# Altium schematic sheet Underglow.SchDoc
size A4; SheetNumber: 1; SheetTotal: 4
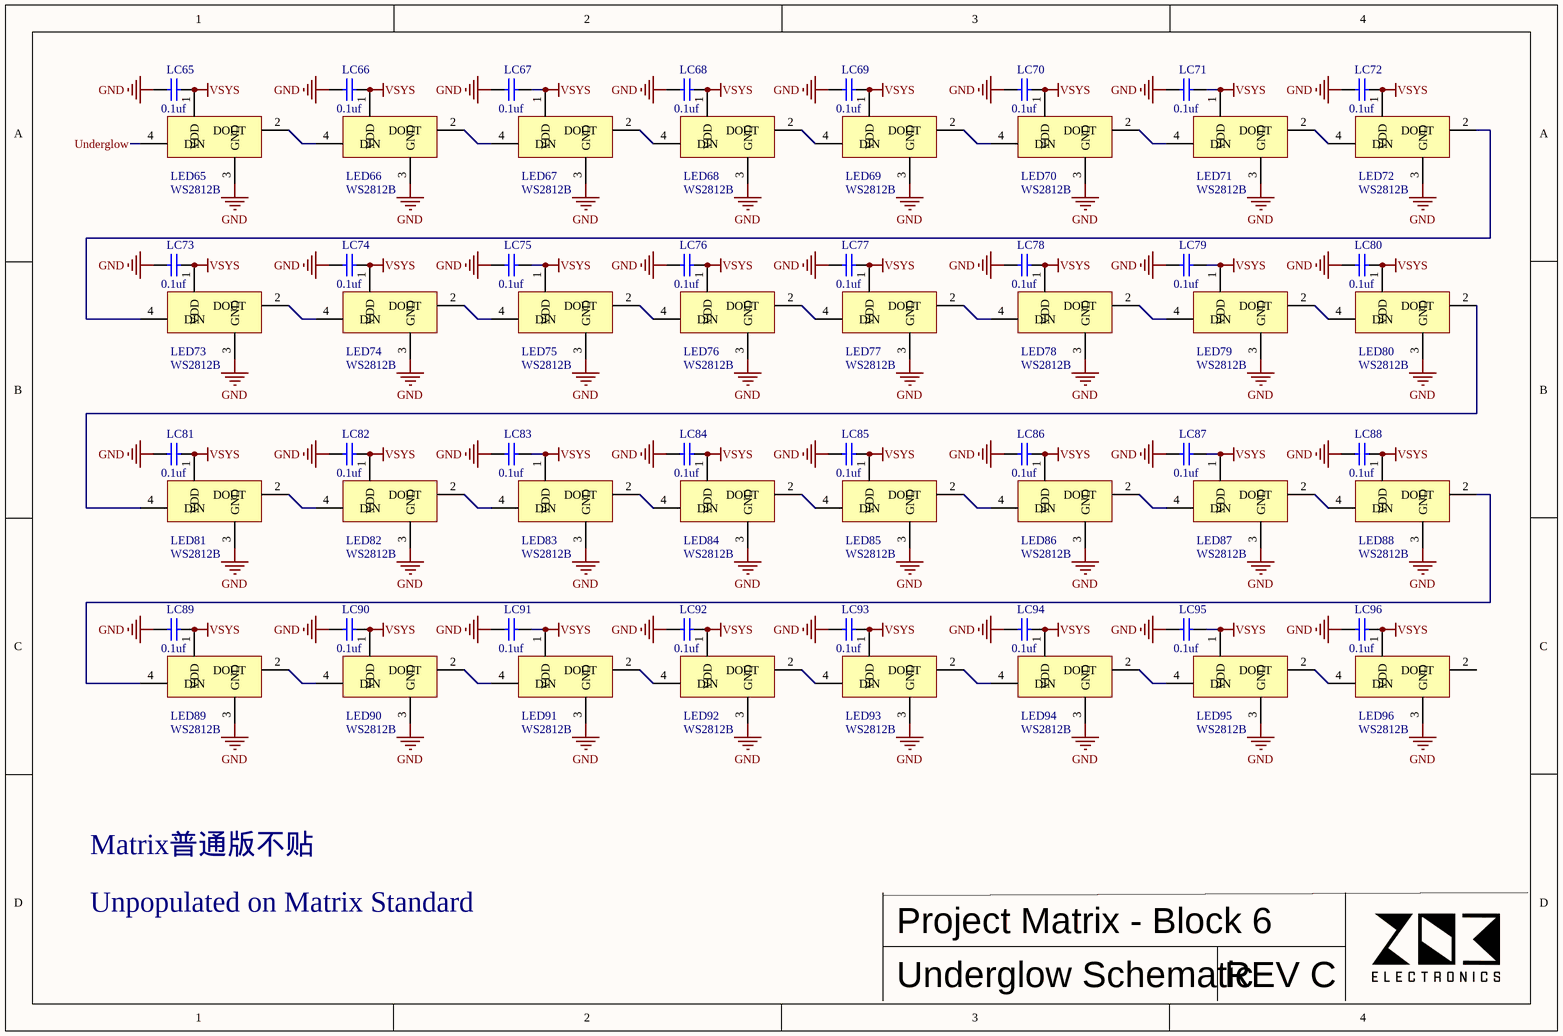
[diagram p0: Underglow.SchDoc]

## Parts
LC65  value 0.1uf  [0603 CAP]  (hidden comment: Cap Semi)
LC66  value 0.1uf  [0603 CAP]  (hidden comment: Cap Semi)
LC67  value 0.1uf  [0603 CAP]  (hidden comment: Cap Semi)
LC68  value 0.1uf  [0603 CAP]  (hidden comment: Cap Semi)
LC69  value 0.1uf  [0603 CAP]  (hidden comment: Cap Semi)
LC70  value 0.1uf  [0603 CAP]  (hidden comment: Cap Semi)
LC71  value 0.1uf  [0603 CAP]  (hidden comment: Cap Semi)
LC72  value 0.1uf  [0603 CAP]  (hidden comment: Cap Semi)
LC73  value 0.1uf  [0603 CAP]  (hidden comment: Cap Semi)
LC74  value 0.1uf  [0603 CAP]  (hidden comment: Cap Semi)
LC75  value 0.1uf  [0603 CAP]  (hidden comment: Cap Semi)
LC76  value 0.1uf  [0603 CAP]  (hidden comment: Cap Semi)
LC77  value 0.1uf  [0603 CAP]  (hidden comment: Cap Semi)
LC78  value 0.1uf  [0603 CAP]  (hidden comment: Cap Semi)
LC79  value 0.1uf  [0603 CAP]  (hidden comment: Cap Semi)
LC80  value 0.1uf  [0603 CAP]  (hidden comment: Cap Semi)
LC81  value 0.1uf  [0603 CAP]  (hidden comment: Cap Semi)
LC82  value 0.1uf  [0603 CAP]  (hidden comment: Cap Semi)
LC83  value 0.1uf  [0603 CAP]  (hidden comment: Cap Semi)
LC84  value 0.1uf  [0603 CAP]  (hidden comment: Cap Semi)
LC85  value 0.1uf  [0603 CAP]  (hidden comment: Cap Semi)
LC86  value 0.1uf  [0603 CAP]  (hidden comment: Cap Semi)
LC87  value 0.1uf  [0603 CAP]  (hidden comment: Cap Semi)
LC88  value 0.1uf  [0603 CAP]  (hidden comment: Cap Semi)
LC89  value 0.1uf  [0603 CAP]  (hidden comment: Cap Semi)
LC90  value 0.1uf  [0603 CAP]  (hidden comment: Cap Semi)
LC91  value 0.1uf  [0603 CAP]  (hidden comment: Cap Semi)
LC92  value 0.1uf  [0603 CAP]  (hidden comment: Cap Semi)
LC93  value 0.1uf  [0603 CAP]  (hidden comment: Cap Semi)
LC94  value 0.1uf  [0603 CAP]  (hidden comment: Cap Semi)
LC95  value 0.1uf  [0603 CAP]  (hidden comment: Cap Semi)
LC96  value 0.1uf  [0603 CAP]  (hidden comment: Cap Semi)
LED65  WS2812B  [3210 LED]
LED66  WS2812B  [3210 LED]
LED67  WS2812B  [3210 LED]
LED68  WS2812B  [3210 LED]
LED69  WS2812B  [3210 LED]
LED70  WS2812B  [3210 LED]
LED71  WS2812B  [3210 LED]
LED72  WS2812B  [3210 LED]
LED73  WS2812B  [3210 LED]
LED74  WS2812B  [3210 LED]
LED75  WS2812B  [3210 LED]
LED76  WS2812B  [3210 LED]
LED77  WS2812B  [3210 LED]
LED78  WS2812B  [3210 LED]
LED79  WS2812B  [3210 LED]
LED80  WS2812B  [3210 LED]
LED81  WS2812B  [3210 LED]
LED82  WS2812B  [3210 LED]
LED83  WS2812B  [3210 LED]
LED84  WS2812B  [3210 LED]
LED85  WS2812B  [3210 LED]
LED86  WS2812B  [3210 LED]
LED87  WS2812B  [3210 LED]
LED88  WS2812B  [3210 LED]
LED89  WS2812B  [3210 LED]
LED90  WS2812B  [3210 LED]
LED91  WS2812B  [3210 LED]
LED92  WS2812B  [3210 LED]
LED93  WS2812B  [3210 LED]
LED94  WS2812B  [3210 LED]
LED95  WS2812B  [3210 LED]
LED96  WS2812B  [3210 LED]

## Nets
GND: LC65.1 LC66.1 LC67.1 LC68.1 LC69.1 LC70.1 LC71.1 LC72.1 LC73.1 LC74.1 LC75.1 LC76.1 LC77.1 LC78.1 LC79.1 LC80.1 LC81.1 LC82.1 LC83.1 LC84.1 LC85.1 LC86.1 LC87.1 LC88.1 LC89.1 LC90.1 LC91.1 LC92.1 LC93.1 LC94.1 LC95.1 LC96.1 LED65.3(GND) LED66.3(GND) LED67.3(GND) LED68.3(GND) LED69.3(GND) LED70.3(GND) LED71.3(GND) LED72.3(GND) LED73.3(GND) LED74.3(GND) LED75.3(GND) LED76.3(GND) LED77.3(GND) LED78.3(GND) LED79.3(GND) LED80.3(GND) LED81.3(GND) LED82.3(GND) LED83.3(GND) LED84.3(GND) LED85.3(GND) LED86.3(GND) LED87.3(GND) LED88.3(GND) LED89.3(GND) LED90.3(GND) LED91.3(GND) LED92.3(GND) LED93.3(GND) LED94.3(GND) LED95.3(GND) LED96.3(GND)
VSYS: LC65.2 LC66.2 LC67.2 LC68.2 LC69.2 LC70.2 LC71.2 LC72.2 LC73.2 LC74.2 LC75.2 LC76.2 LC77.2 LC78.2 LC79.2 LC80.2 LC81.2 LC82.2 LC83.2 LC84.2 LC85.2 LC86.2 LC87.2 LC88.2 LC89.2 LC90.2 LC91.2 LC92.2 LC93.2 LC94.2 LC95.2 LC96.2 LED65.1(VDD) LED66.1(VDD) LED67.1(VDD) LED68.1(VDD) LED69.1(VDD) LED70.1(VDD) LED71.1(VDD) LED72.1(VDD) LED73.1(VDD) LED74.1(VDD) LED75.1(VDD) LED76.1(VDD) LED77.1(VDD) LED78.1(VDD) LED79.1(VDD) LED80.1(VDD) LED81.1(VDD) LED82.1(VDD) LED83.1(VDD) LED84.1(VDD) LED85.1(VDD) LED86.1(VDD) LED87.1(VDD) LED88.1(VDD) LED89.1(VDD) LED90.1(VDD) LED91.1(VDD) LED92.1(VDD) LED93.1(VDD) LED94.1(VDD) LED95.1(VDD) LED96.1(VDD)
Underglow: LED65.4(DIN)
NetLED65_2: LED65.2(DOUT) LED66.4(DIN)
NetLED66_2: LED66.2(DOUT) LED67.4(DIN)
NetLED67_2: LED67.2(DOUT) LED68.4(DIN)
NetLED68_2: LED68.2(DOUT) LED69.4(DIN)
NetLED69_2: LED69.2(DOUT) LED70.4(DIN)
NetLED70_2: LED70.2(DOUT) LED71.4(DIN)
NetLED71_2: LED71.2(DOUT) LED72.4(DIN)
NetLED72_2: LED72.2(DOUT) LED73.4(DIN)
NetLED73_2: LED73.2(DOUT) LED74.4(DIN)
NetLED74_2: LED74.2(DOUT) LED75.4(DIN)
NetLED75_2: LED75.2(DOUT) LED76.4(DIN)
NetLED76_2: LED76.2(DOUT) LED77.4(DIN)
NetLED77_2: LED77.2(DOUT) LED78.4(DIN)
NetLED78_2: LED78.2(DOUT) LED79.4(DIN)
NetLED79_2: LED79.2(DOUT) LED80.4(DIN)
NetLED80_2: LED80.2(DOUT) LED81.4(DIN)
NetLED81_2: LED81.2(DOUT) LED82.4(DIN)
NetLED82_2: LED82.2(DOUT) LED83.4(DIN)
NetLED83_2: LED83.2(DOUT) LED84.4(DIN)
NetLED84_2: LED84.2(DOUT) LED85.4(DIN)
NetLED85_2: LED85.2(DOUT) LED86.4(DIN)
NetLED86_2: LED86.2(DOUT) LED87.4(DIN)
NetLED87_2: LED87.2(DOUT) LED88.4(DIN)
NetLED88_2: LED88.2(DOUT) LED89.4(DIN)
NetLED89_2: LED89.2(DOUT) LED90.4(DIN)
NetLED90_2: LED90.2(DOUT) LED91.4(DIN)
NetLED91_2: LED91.2(DOUT) LED92.4(DIN)
NetLED92_2: LED92.2(DOUT) LED93.4(DIN)
NetLED93_2: LED93.2(DOUT) LED94.4(DIN)
NetLED94_2: LED94.2(DOUT) LED95.4(DIN)
NetLED95_2: LED95.2(DOUT) LED96.4(DIN)

Not connected (* = marked no-connect by the designer): LED96 2(DOUT)

## Notes on the sheet
- Matrix普通版不贴
- Unpopulated on Matrix Standard
- Project Matrix - Block 6
- Underglow Schematic
- REV C

## Library data of the parts
LC65-LC96 = Cap Semi: Capacitor (Semiconductor SIM Model); Published: 8-Jun-2000; LatestRevisionDate: 29-May-2009; LatestRevisionNote: IPC-7351 Footprint Added.; PackageReference: C1206; Publisher: Altium Limited; PackageDescription: Chip Capacitor
LED65-LED96 = WS2812B: 3535